# EAGLE design APDS-9301_Breakout (EAGLE 7.7.0)
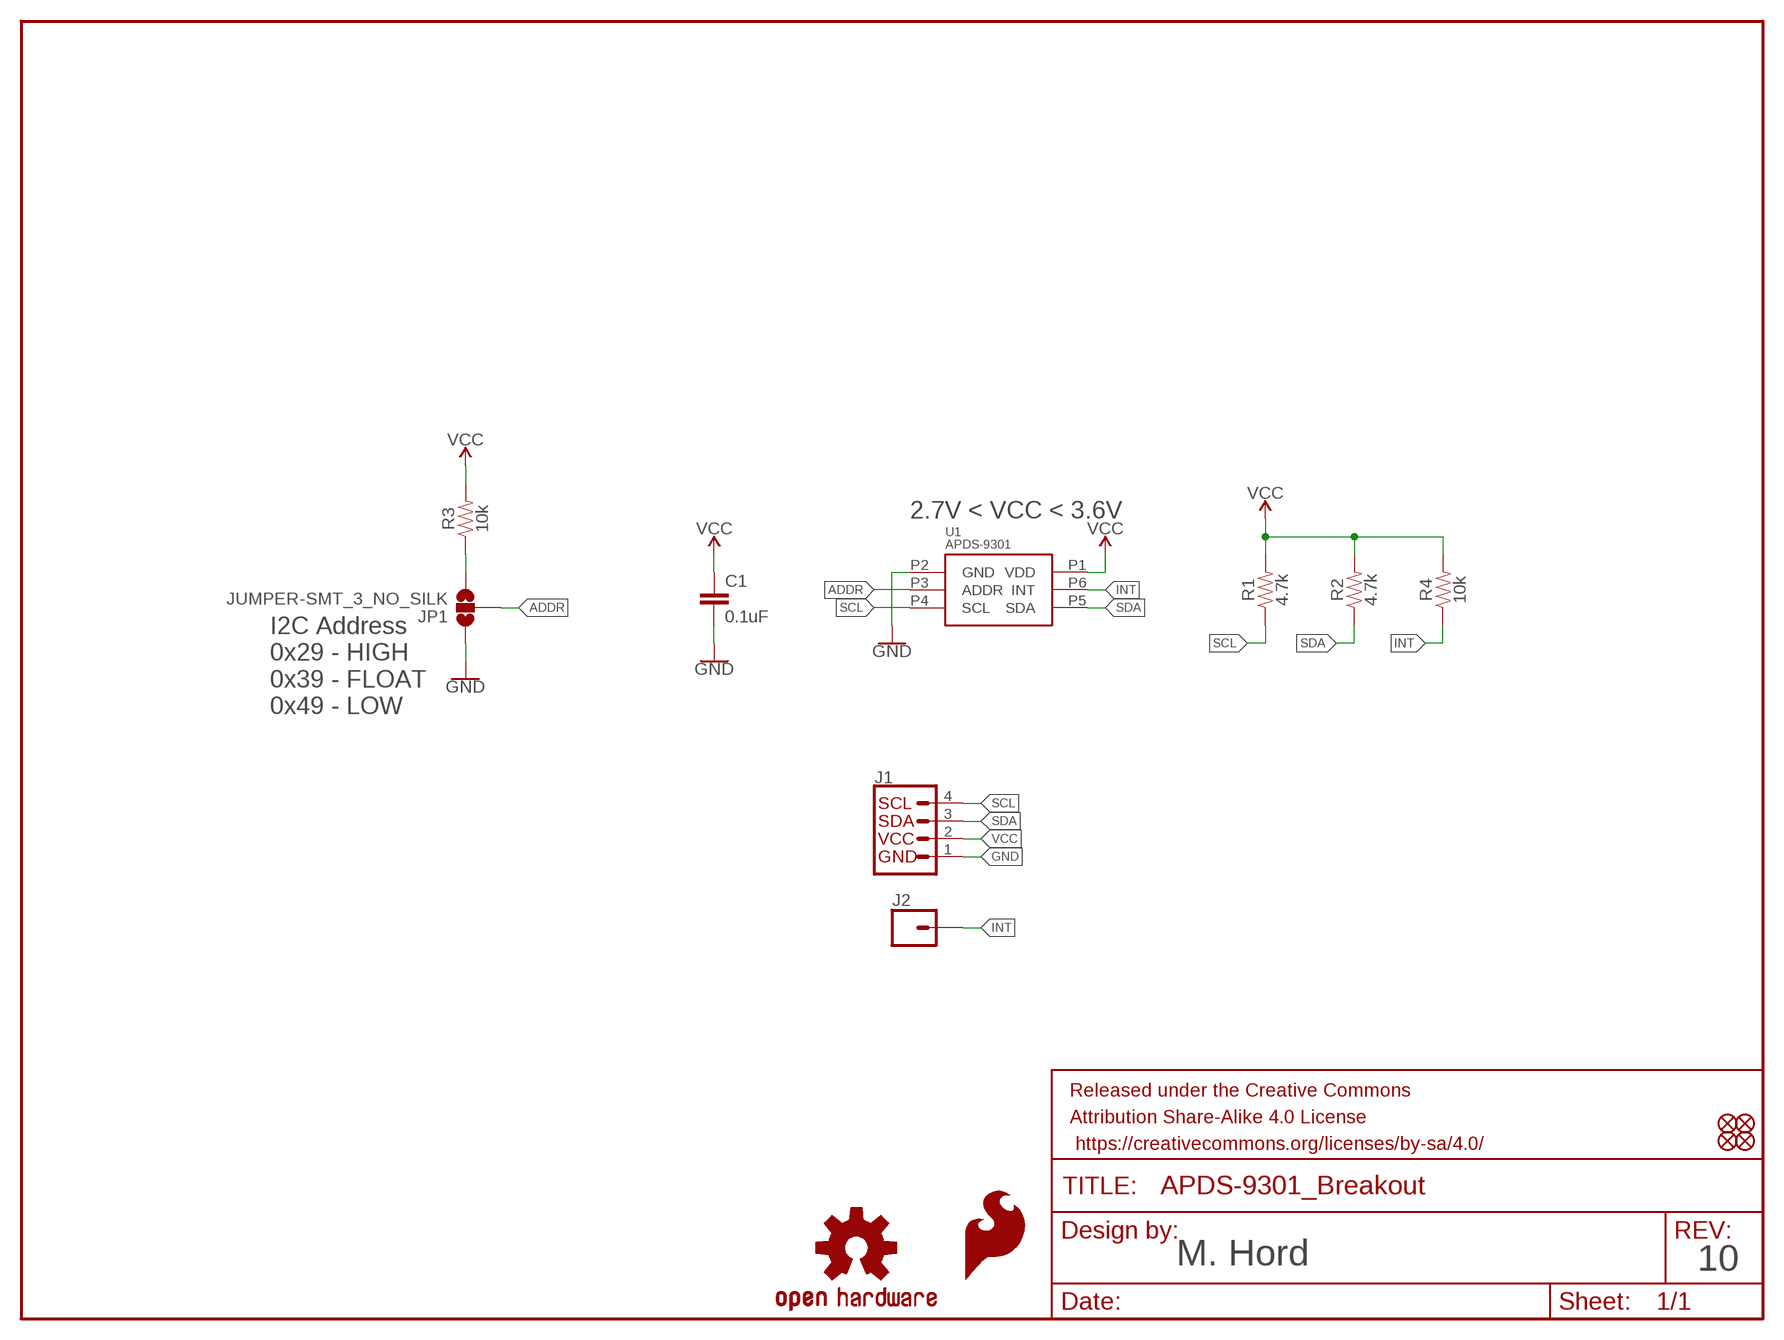
[diagram p0: schematic, sheet 1]

## Parts
C1  0.1uF  0.1UF-0603-25V-5%  [0603]
FD1  FIDUCIALUFIDUCIAL  [FIDUCIAL-MICRO]
FD2  FIDUCIALUFIDUCIAL  [FIDUCIAL-MICRO]
FD3  FIDUCIALUFIDUCIAL  [FIDUCIAL-MICRO]
FD4  FIDUCIALUFIDUCIAL  [FIDUCIAL-MICRO]
FRAME1  FRAME-LETTER  [CREATIVE_COMMONS]
J1  I2C_STANDARD  [1X04]
J2  CONN_01  [1X01]
JP1  JUMPER-SMT_3_NO_SILK  [SMT-JUMPER_3_NO_SILK]
LOGO1  SFE_LOGO_FLAME.1_INCH  [SFE_LOGO_FLAME_.1]
LOGO2  OSHW-LOGOS  [OSHW-LOGO-S]
R1  4.7k  4.7KOHM-0603-1/10W-1%  [0603]
R2  4.7k  4.7KOHM-0603-1/10W-1%  [0603]
R3  10k  10KOHM-0603-1/10W-1%  [0603]
R4  10k  10KOHM-0603-1/10W-1%  [0603]
U1  APDS-9301  [CHIPLED-6]

## Nets
ADDR: JP1.2 U1.P3(ADDR)
GND: C1.2 J1.1 JP1.1 U1.P2(GND)
INT: J2.1 R4.1 U1.P6(INT)
N$1: JP1.3 R3.1
SCL: J1.4 R1.1 U1.P4(SCL)
SDA: J1.3 R2.1 U1.P5(SDA)
VCC: C1.1 J1.2 R1.2 R2.2 R3.2 R4.2 U1.P1(VDD)

## Notes on the sheet
- 2.7V < VCC < 3.6V
- I2C Address
  0x29 - HIGH
  0x39 - FLOAT
  0x49 - LOW
- M. Hord | 10

## Library data of the parts
C1 = SparkFun-Capacitors:0.1UF: 0.1µF ceramic capacitors A capacitor is a passive two-terminal electrical component used to store electrical energy temporarily in an electric field.; PROD_ID: CAP-08604
FD1-FD4 = SparkFun-Aesthetics:FIDUCIAL: Fiducial Alignment Points Point-of-reference for pick-and-place machines and other optical instruments.
FRAME1 = SparkFun-Aesthetics:FRAME-LETTER: Schematic Frame - Letter Standard 8.5x11 US Letter frame
J1 = SparkFun-Connectors:I2C_STANDARD: SparkFun I2C Standard Pinout Header SparkFun has standardized on a pinout for all I2C based sensor breakouts. This pinout allows I2C boards to be plugged directly into the headers on Arduino Uno compatible boards, and to be daisy chained easily. Example SparkFun Products: SparkFun Atmospheric Sensor Breakout - BME280 <https://www.sparkfun.com/products/13676> SparkFun Altitude/Pressure Sensor Breakout - MPL3115A2 <https://www.sparkfun.com/products/11084> SparkFun TOF Range Finder Sensor - VL6180 <https://www.sparkfun.com/products/12785>
J2 = SparkFun-Connectors:CONN_01: Single connection point. Often used as Generic Header-pin footprint for 0.1 inch spaced/style header connections On any of the 0.1 inch spaced packages, you can populate with these: Break Away Headers - Straight <https://www.sparkfun.com/products/116> (PRT-00116) Break Away Male Headers - Right Angle <https://www.sparkfun.com/products/553> (PRT-00553) Female Headers <https://www.sparkfun.com/products/115> (PRT-00115) Break Away Headers - Machine Pin <https://www.sparkfun.com/products/117> (PRT-00117) Break Away Female Headers - Swiss Machine Pin <https://www.sparkfun.com/products/743> (PRT-00743) This device is also useful as a general connection point to wire up your design to another part of your project. Our various solder wires solder well into these plated through hole pads. Hook-Up Wire - Assortment (Stranded, 22 AWG) <https://www.sparkfun.com/products/11375> (PRT-11375) Hook-Up Wire - Assortment (Solid Core, 22 AWG) <https://www.sparkfun.com/products/11367> (PRT-11367) View the entire wire category on our website here <https://www.sparkfun.com/categories/141> Special notes: SMTSO-256-ET is a "flush mount" nut for a 4-40 screw. We mostly use this on specialty testbeds; it is a nice way to connect hardware to your PCB at an adjustable hieght. Also note, the SNAP packages are for using a snappable style connector. We sell a baggie of snaps and they are also used on two LilyPad designs: Snap Assortment - 30 pack (male and female) <https://www.sparkfun.com/products/11347> (DEV-11347) LilyPad Arduino SimpleSnap <https://www.sparkfun.com/products/10941> (DEV-10941) LilyPad SimpleSnap Protoboard <https://www.sparkfun.com/products/10940> (DEV-10940)
JP1 = SparkFun-Jumpers:JUMPER-SMT_3_NO: Normally open jumper This jumper has three pads in close proximity to each other. Apply solder to close the connection(s).
LOGO1 = SparkFun-Aesthetics:SFE_LOGO_FLAME: SparkFun Flame Logo This is the SparkFun flame logo. The logo on the schematic will always be the same size; the package variant is the height of the flame. Default layer for the logo on the board is tSilk.
LOGO2 = SparkFun-Aesthetics:OSHW-LOGO: Open-Source Hardware (OSHW) Logo This logo indicates the piece of hardware it is found on incorporates a OSHW license and/or adheres to the definition of open source hardware found here: http://freedomdefined.org/OSHW
R1 R2 = SparkFun-Resistors:4.7KOHM: 4.7kΩ resistor A resistor is a passive two-terminal electrical component that implements electrical resistance as a circuit element. Resistors act to reduce current flow, and, at the same time, act to lower voltage levels within circuits. - Wikipedia; PROD_ID: RES-07857
R3 R4 = SparkFun-Resistors:10KOHM: 10kΩ resistor A resistor is a passive two-terminal electrical component that implements electrical resistance as a circuit element. Resistors act to reduce current flow, and, at the same time, act to lower voltage levels within circuits. - Wikipedia; PROD_ID: RES-00824
U1 = SparkFun-Sensors:APDS-9301; PROD_ID: IC-13662

## Board
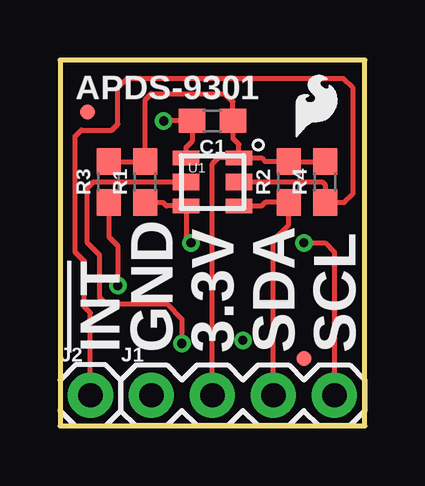
[diagram p1: board, top side]
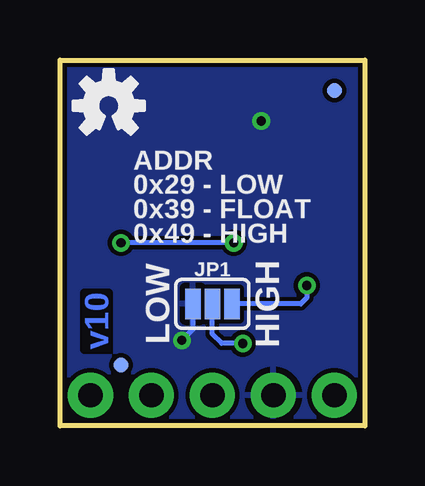
[diagram p2: board, bottom side, seen from below]

Size 12.7 x 15.24 mm. Coordinates in mm from the lower left corner, seen from the top.
Outline: 0,0 12.7,0 12.7,15.24 0,15.24 0,0
Copper layers (1*16): Top 0.035mm / dielectric 1.5mm / Bottom 0.035mm
Design rules "SparkFun-2-layer-TIGHT": minimum track width 7mil, minimum drill 15mil, track to track 7mil, track to pad 7mil, pad to pad 7mil, via to via 7mil, smd to smd 7mil, copper to edge 7mil, drill to drill 7mil, minimum pad ring 7mil, minimum via ring 7mil, stop-mask expansion 4mil, vias tented up to drill 25mil, thermal gap 10mil

### Footprints (pad centres in the part's own frame; a part is rotated, then mirrored left to right if it is on the bottom)
0603 = smd 1.1 x 1: 1 -0.85,0; 2 0.85,0
FIDUCIAL-MICRO = smd 0.635 x 0.635: 1 0,0
1X04 = drill 1.016 pad 1.88: 1 0,0; 2 2.54,0; 3 5.08,0; 4 7.62,0
1X01 = drill 1.016 pad 1.88: 1 0,0
SMT-JUMPER_3_NO_SILK = smd 0.635 x 1.27: 1 -0.813,0; 2 0,0; 3 0.813,0
CHIPLED-6 = smd 1.1 x 0.6: P1 1.1,1; P2 -1.1,1; P4 -1.1,-1; P5 1.1,-1 | smd 1.1 x 0.7: P3 -1.1,0; P6 1.1,0

### Placement (x,y rotation side)
C1  6.35,12.7 180 top
FD1  1.14,13.08 0 top
FD2  10.16,2.79 0 top
FD3  1.27,13.97 0 bottom
FD4  10.16,2.54 0 bottom
FRAME1  -26.67,-16.51 0 top  (outside the outline)
J1  3.81,1.27 0 top
J2  1.27,1.27 0 top
JP1  6.35,5.08 0 bottom
LOGO1  9.53,11.68 0 top
LOGO2  10.67,13.34 0 bottom
R1  3.56,10.16 90 top
R2  9.53,10.16 90 top
R3  2.03,10.16 90 top
R4  11.05,10.16 90 top
U1  6.35,10.16 0 top

### Tracks (layer width: path | path; a pad name or v marks a point on that pad's centre or on a via)
ADDR  (via drill 0.38)
  Top 0.203: v5.08,3.43 5.08,4.45 4.45,5.08 1.91,5.08 1.65,5.33 1.65,7.11 1.14,7.62 1.14,9.91 1.4,10.16 U1.P3
  Bottom 0.203: v5.08,3.43 5.97,3.43 6.35,3.81 JP1.2
GND  (via drill 0.38)
  Top 0.203: U1.P2 5.25,11.6 5.5,11.85 C1.2 v4.32,12.7
  Bottom 0.203: JP1.1 7.16,4.01 v7.62,3.56
  pour Bottom: 0,15.24 12.7,15.24 12.7,0 0,0
INT
  Top 0.203: U1.P6 10.92,10.16 11.05,10.03 R4.1 11.85,9.31 12.19,9.65 12.19,14.1 11.81,14.48 2.79,14.48 2.41,14.1 2.41,12.57 2.16,12.32 0.89,12.32 0.64,12.06 0.64,7.24 1.02,6.86 1.02,4.95 1.27,4.7 J2.1
N$1  (via drill 0.38)
  Top 0.203: R3.1 2.03,7.87 2.41,7.49 v2.41,5.84
  Bottom 0.203: v2.41,5.84 2.41,5.33 2.67,5.08 JP1.3
SCL  (via drill 0.38)
  Top 0.203: R1.1 4.28,9.31 4.43,9.16 U1.P4 5.25,7.83 v5.46,7.62 | v10.16,7.62 11.05,7.62 11.43,7.24 J1.4
  Bottom 0.203: v5.46,7.62 v10.16,7.62
SDA
  Top 0.203: U1.P5 8.4,9.16 8.55,9.31 R2.1 9.53,8.38 8.89,7.75 J1.3
VCC
  Top 0.203: J1.2 6.35,10.92 6.59,11.16 U1.P1 | U1.P1 7.45,11.73 7.2,11.98 C1.1 7.2,13.5 6.86,13.84 3.81,13.84 3.56,13.59 R1.2 R3.2 | U1.P1 8.4,11.16 8.55,11.01 R2.2 R4.2

### Text on the board
Bottom: v10
tPlace: APDS-9301 | !INT | GND | 3.3V | SDA | SCL
bPlace: ADDR / 0x29 - LOW / 0x39 - FLOAT / 0x49 - HIGH | HIGH | LOW
Measures: All units in inches
tDocu: M. Hord